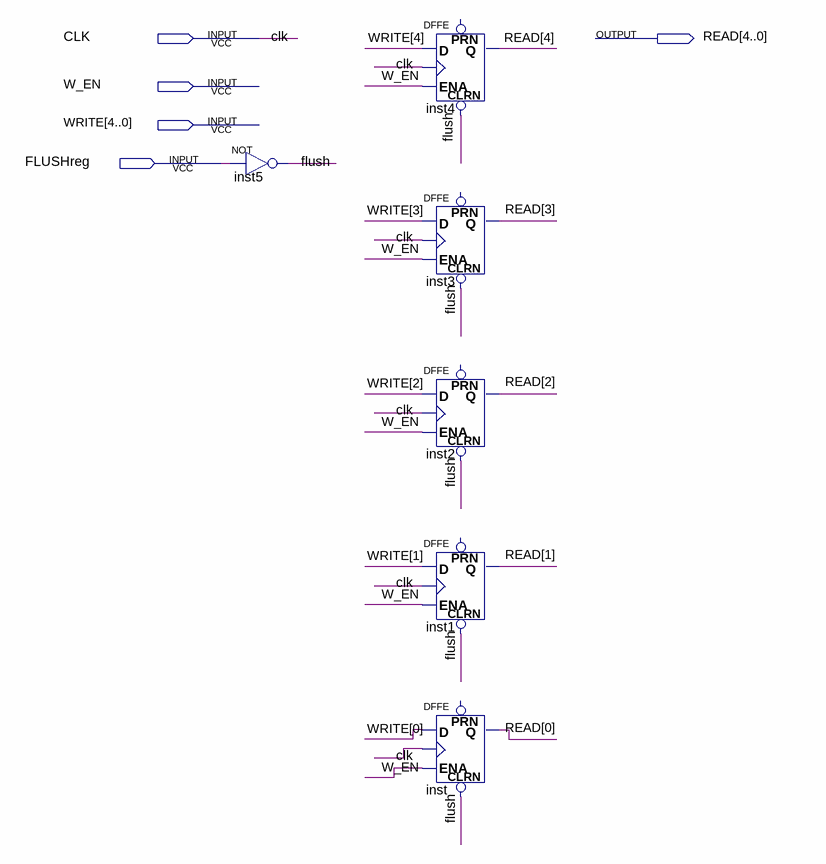
[diagram p0: schematic sheet]
// Quartus schematic reg5.bdf as structural Verilog: 6 symbols, 5 pins
module reg5 (
  input  CLK,
  input  W_EN,
  input  [4:0] WRITE,
  input  FLUSHreg,
  output [4:0] READ
);

  wire flush;

  not inst5 (flush, FLUSHreg);
  DFFE inst4 (.CLRN(flush), .D(WRITE[4]), .CLK(CLK), .ENA(W_EN), .Q(READ[4]));  // open: PRN
  DFFE inst3 (.CLRN(flush), .D(WRITE[3]), .CLK(CLK), .ENA(W_EN), .Q(READ[3]));  // open: PRN
  DFFE inst2 (.CLRN(flush), .D(WRITE[2]), .CLK(CLK), .ENA(W_EN), .Q(READ[2]));  // open: PRN
  DFFE inst1 (.CLRN(flush), .D(WRITE[1]), .CLK(CLK), .ENA(W_EN), .Q(READ[1]));  // open: PRN
  DFFE inst (.CLRN(flush), .D(WRITE[0]), .CLK(CLK), .ENA(W_EN), .Q(READ[0]));  // open: PRN
endmodule
